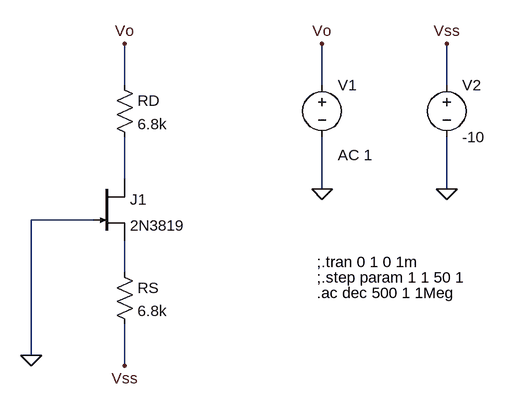
[diagram p0: schematic Fuente de corriente.asc]
Fuente de corriente.asc, the LTspice schematic file:
Version 4
SHEET 1 880 680
WIRE 192 -32 192 -96
WIRE 496 -32 496 -96
WIRE 688 -32 688 -96
WIRE 192 112 192 48
WIRE 496 128 496 48
WIRE 688 128 688 48
WIRE 144 176 48 176
WIRE 192 256 192 208
WIRE 48 384 48 176
WIRE 192 400 192 336
FLAG 48 384 0
FLAG 192 -96 Vo
FLAG 496 -96 Vo
FLAG 192 400 Vss
FLAG 688 -96 Vss
FLAG 496 128 0
FLAG 688 128 0
SYMBOL njf 144 112 R0
SYMATTR InstName J1
SYMATTR Value 2N3819
SYMBOL res 176 -48 R0
SYMATTR InstName RD
SYMATTR Value 6.8k
SYMATTR SpiceLine tol=1
SYMBOL res 176 240 R0
SYMATTR InstName RS
SYMATTR Value 6.8k
SYMATTR SpiceLine tol=1
SYMBOL voltage 496 -48 R0
WINDOW 123 24 124 Left 2
WINDOW 39 0 0 Left 0
SYMATTR Value2 AC 1
SYMATTR InstName V1
SYMATTR Value ""
SYMBOL voltage 688 -48 R0
WINDOW 123 0 0 Left 0
WINDOW 39 0 0 Left 0
SYMATTR InstName V2
SYMATTR Value -10
TEXT 488 264 Left 2 !;.step param 1 1 50 1
TEXT 488 240 Left 2 !;.tran 0 1 0 1m
TEXT 488 288 Left 2 !.ac dec 500 1 1Meg

The netlist it stands for:
* Fuente de corriente.asc
J1 N001 0 N002 2N3819
RD Vo N001 6.8k tol=1
RS N002 Vss 6.8k tol=1
V1 Vo 0 AC 1
V2 Vss 0 -10
.model NJF NJF
.model PJF PJF
.lib standard.jft
;.step param 1 1 50 1
;.tran 0 1 0 1m
.ac dec 500 1 1Meg
.backanno
.end